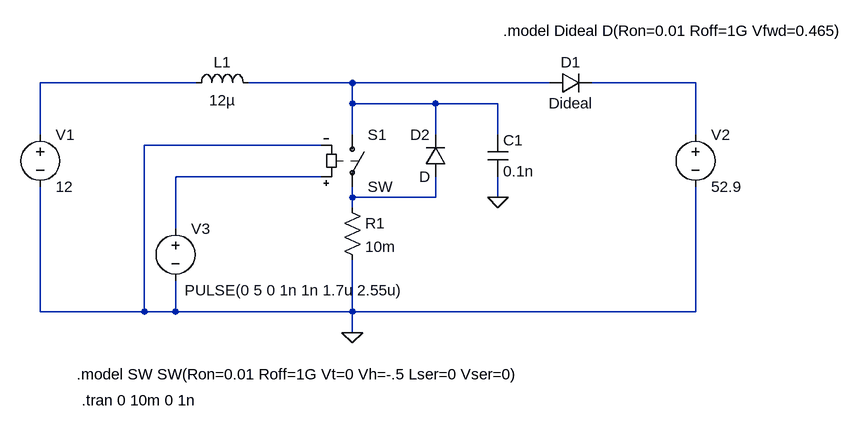
[diagram p0: schematic resonanceTest.asc]
resonanceTest.asc, the LTspice schematic file:
Version 4
SHEET 1 1104 680
WIRE 16 96 -224 96
WIRE 256 96 96 96
WIRE 560 96 256 96
WIRE 784 96 624 96
WIRE 256 128 256 96
WIRE 384 128 256 128
WIRE 480 128 384 128
WIRE -224 176 -224 96
WIRE 256 176 256 128
WIRE 384 176 384 128
WIRE 480 176 480 128
WIRE 784 176 784 96
WIRE 208 192 -64 192
WIRE 208 240 -16 240
WIRE 256 272 256 256
WIRE 384 272 384 240
WIRE 384 272 256 272
WIRE 480 272 480 240
WIRE 256 288 256 272
WIRE -16 320 -16 240
WIRE -224 448 -224 256
WIRE -64 448 -64 192
WIRE -64 448 -224 448
WIRE -16 448 -16 400
WIRE -16 448 -64 448
WIRE 256 448 256 368
WIRE 256 448 -16 448
WIRE 784 448 784 256
WIRE 784 448 256 448
WIRE 256 480 256 448
FLAG 256 480 0
FLAG 480 272 0
SYMBOL voltage -224 160 R0
WINDOW 123 0 0 Left 2
WINDOW 39 0 0 Left 2
SYMATTR InstName V1
SYMATTR Value 12
SYMBOL ind 0 112 R270
WINDOW 0 32 56 VTop 2
WINDOW 3 5 56 VBottom 2
SYMATTR InstName L1
SYMATTR Value 12µ
SYMATTR SpiceLine Rser=20m
SYMBOL diode 560 112 R270
WINDOW 0 32 32 VTop 2
WINDOW 3 0 32 VBottom 2
SYMATTR InstName D1
SYMATTR Value Dideal
SYMBOL sw 256 160 R0
SYMATTR InstName S1
SYMBOL voltage -16 304 R0
WINDOW 3 14 111 Left 2
WINDOW 123 0 0 Left 2
WINDOW 39 0 0 Left 2
SYMATTR Value PULSE(0 5 0 1n 1n 1.7u 2.55u)
SYMATTR InstName V3
SYMBOL voltage 784 160 R0
WINDOW 123 0 0 Left 2
WINDOW 39 0 0 Left 2
SYMATTR InstName V2
SYMATTR Value 52.9
SYMBOL res 240 272 R0
SYMATTR InstName R1
SYMATTR Value 10m
SYMBOL cap 464 176 R0
SYMATTR InstName C1
SYMATTR Value 0.1n
SYMBOL diode 400 240 R180
WINDOW 0 24 64 Left 2
WINDOW 3 24 0 Left 2
SYMATTR InstName D2
TEXT -168 544 Left 2 !.model SW SW(Ron=0.01 Roff=1G Vt=0 Vh=-.5 Lser=0 Vser=0)
TEXT -160 584 Left 2 !.tran 0 10m 0 1n
TEXT 488 16 Left 2 !.model Dideal D(Ron=0.01 Roff=1G Vfwd=0.465)

The netlist it stands for:
* resonanceTest.asc
V1 N001 0 12
L1 N001 N002 12µ Rser=20m
D1 N002 N003 Dideal
S1 N002 N005 N004 0 SW
V3 N004 0 PULSE(0 5 0 1n 1n 1.7u 2.55u)
V2 N003 0 52.9
R1 N005 0 10m
C1 N002 0 0.1n
D2 N005 N002 D
.model D D
.lib standard.dio
.model SW SW(Ron=0.01 Roff=1G Vt=0 Vh=-.5 Lser=0 Vser=0)
.tran 0 10m 0 1n
.model Dideal D(Ron=0.01 Roff=1G Vfwd=0.465)
.backanno
.end